# EAGLE schematic AnalogSimulator (EAGLE 7.2.0)
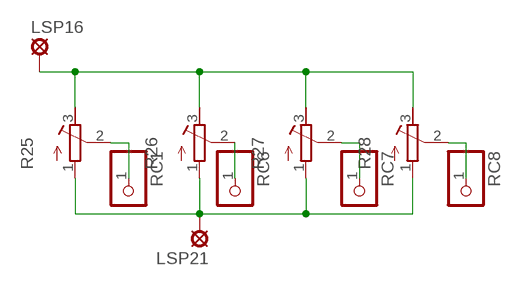
[diagram p0: schematic, sheet 1]

## Parts
LSP16  LSP10  [LSP10]
LSP21  LSP10  [LSP10]
R25  R-TRIMM3339P  [RTRIM3339P]
R26  R-TRIMM3339P  [RTRIM3339P]
R27  R-TRIMM3339P  [RTRIM3339P]
R28  R-TRIMM3339P  [RTRIM3339P]
RC1  PINHD-1X1  [1X01]
RC6  PINHD-1X1  [1X01]
RC7  PINHD-1X1  [1X01]
RC8  PINHD-1X1  [1X01]

## Nets
N$100: R25.2(S) RC1.1
N$101: R26.2(S) RC6.1
N$102: R27.2(S) RC7.1
N$103: R28.2(S) RC8.1
N$124: LSP16.MP R25.3(E) R26.3(E) R27.3(E) R28.3(E)
N$128: LSP21.MP R25.1(A) R26.1(A) R27.1(A) R28.1(A)

## Library data of the parts
LSP16 LSP21 = solpad:LSP10: SOLDER PAD drill 1.0 mm, distributor Buerklin, 12H555
R25-R28 = resistor:R-TRIMM: Trimm resistor
RC1 RC6-RC8 = pinhead:PINHD-1X1: PIN HEADER